# Altium schematic sheet controller_power.SchDoc
size A
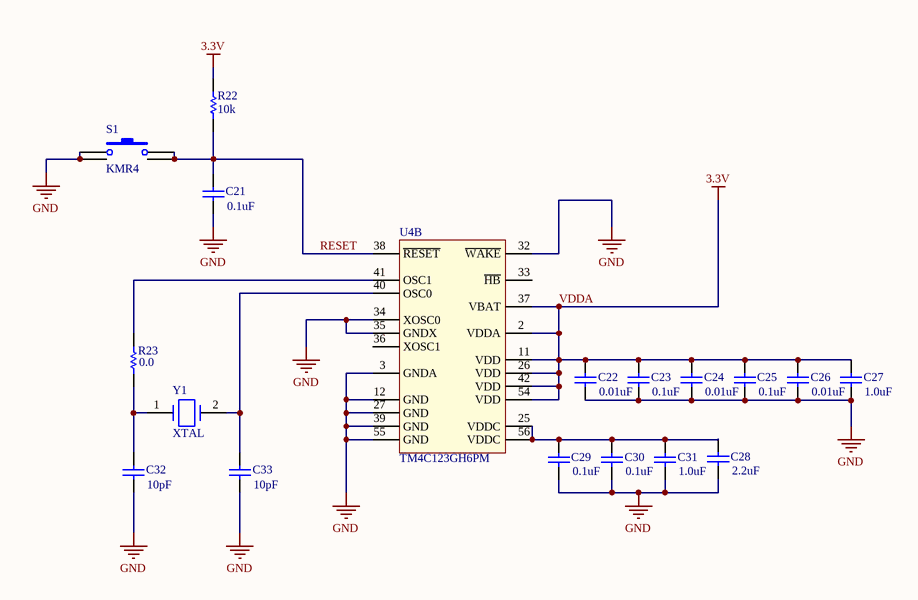
[diagram p0: controller_power.SchDoc]

## Parts
C21  value 0.1uF  [1608[0603]]  (hidden comment: Cap Semi)
C22  value 0.01uF  [1608[0603]]  (hidden comment: Cap Semi)
C23  value 0.1uF  [1608[0603]]  (hidden comment: Cap Semi)
C24  value 0.01uF  [1608[0603]]  (hidden comment: Cap Semi)
C25  value 0.1uF  [1608[0603]]  (hidden comment: Cap Semi)
C26  value 0.01uF  [1608[0603]]  (hidden comment: Cap Semi)
C27  value 1.0uF  [1608[0603]]  (hidden comment: Cap Semi)
C28  value 2.2uF  [1608[0603]]  (hidden comment: Cap Semi)
C29  value 0.1uF  [1608[0603]]  (hidden comment: Cap Semi)
C30  value 0.1uF  [1608[0603]]  (hidden comment: Cap Semi)
C31  value 1.0uF  [1608[0603]]  (hidden comment: Cap Semi)
C32  value 10pF  [1608[0603]]  (hidden comment: Cap Semi)
C33  value 10pF  [1608[0603]]  (hidden comment: Cap Semi)
R22  value 10k  [0603]  (hidden comment: Resistor)
R23  value 0.0  [0603]  (hidden comment: Resistor)
S1  KMR4  [KMR4]
U4  TM4C123GH6PM  [TSQFP50P1200X1200X145-64N]  (part B of 2)
Y1  XTAL  [ABM3_SERIES]

## Nets
GND: C21.1 C22.1 C23.1 C24.1 C25.1 C26.1 C27.1 C28.1 C29.1 C30.1 C31.1 C32.1 C33.1 S1.1 S1.3 U4.3(GNDA) U4.12(GND) U4.27(GND) U4.32(~{WAKE}) U4.34(XOSC0) U4.35(GNDX) U4.39(GND) U4.55(GND)
VDDA: C22.2 C23.2 C24.2 C25.2 C26.2 C27.2 R22.2 U4.2(VDDA) U4.11(VDD) U4.26(VDD) U4.37(VBAT) U4.42(VDD) U4.54(VDD)  [also labelled 3.3V]
RESET: C21.2 R22.1 S1.2 S1.4 U4.38(~{RESET})
NetC28_2: C28.2 C29.2 C30.2 C31.2 U4.25(VDDC) U4.56(VDDC)
NetC32_2: C32.2 R23.1 Y1.1(OSC1)
NetC33_2: C33.2 U4.40(OSC0) Y1.2(OSC2)
NetR23_2: R23.2 U4.41(OSC1)

Not connected (* = marked no-connect by the designer): U4 33(~{HB}) 36(XOSC1)

## Library data of the parts
C21-C33 = Cap Semi: Capacitor (Semiconductor SIM Model); Published: 8-Jun-2000; LatestRevisionDate: 29-May-2009; LatestRevisionNote: IPC-7351 Footprint Added.; PackageReference: C1206; Publisher: Altium Limited; PackageDescription: Chip Capacitor
S1 = SPST Tactile Switch: Switch; Published: 24-Mar-1999; LatestRevisionDate: 17-Jul-2002; LatestRevisionNote: Re-released for DXP Platform.; PackageReference: SPST-2; Publisher: Altium Limited
U4 = TM4C123GH6PM: Tiva C TM4C123GH6PM
Y1 = XTAL: Crystal Oscillator; Published: 8-Jun-2000; LatestRevisionDate: 17-Jul-2002; LatestRevisionNote: Re-released for DXP Platform.; PackageReference: R38; Publisher: Altium Limited; PackageDescription: Crystal, Thru-Hole; 2 Leads; Body 3.1 x 8.2 mm (Dia.xH)
R22 R23 = Resistor: Published: 8-Jun-2000; LatestRevisionDate: 17-Jul-2002; LatestRevisionNote: Re-released for DXP Platform.; PackageReference: AXIAL-0.3; Publisher: Altium Limited